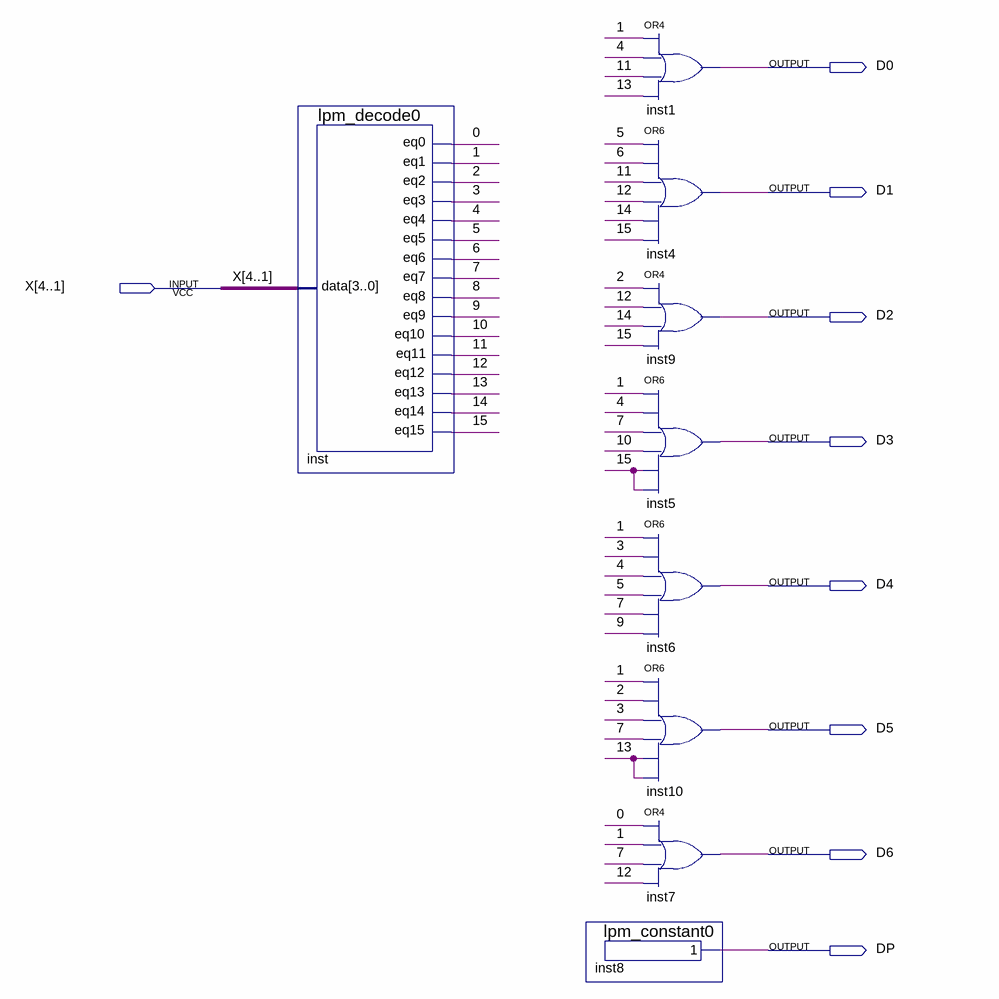
[diagram p0: schematic sheet]
// Quartus schematic seven_seg.bdf as structural Verilog: 9 symbols, 9 pins
module seven_seg (
  input  [4:1] X,
  output D0,
  output D1,
  output D2,
  output D3,
  output D4,
  output D5,
  output D6,
  output DP
);

  wire \0 , \1 , \2 , \3 , \4 , \5 , \6 , \7 , \8 , \9 , \10 , \11 , \12 , \13 , \14 , \15 ;

  lpm_decode0 inst (
    .data(X), .eq0(\0 ), .eq1(\1 ), .eq2(\2 ), .eq3(\3 ), .eq4(\4 ), .eq5(\5 ), .eq6(\6 ), .eq7(\7 ),
    .eq8(\8 ), .eq9(\9 ), .eq10(\10 ), .eq11(\11 ), .eq12(\12 ), .eq13(\13 ), .eq14(\14 ), .eq15(\15 ));
  lpm_constant0 inst8 (.result(DP));
  or inst1 (D0, \1 , \4 , \11 , \13 );
  or inst4 (D1, \5 , \6 , \11 , \12 , \14 , \15 );
  or inst9 (D2, \2 , \12 , \14 , \15 );
  or inst5 (D3, \1 , \4 , \7 , \10 , \15 , \15 );
  or inst6 (D4, \1 , \3 , \4 , \5 , \7 , \9 );
  or inst10 (D5, \1 , \2 , \3 , \7 , \13 , \13 );
  or inst7 (D6, \0 , \1 , \7 , \12 );
endmodule
